# EAGLE design tb_projekt_rf433_shield_mini_revA (EAGLE 7.6.0)
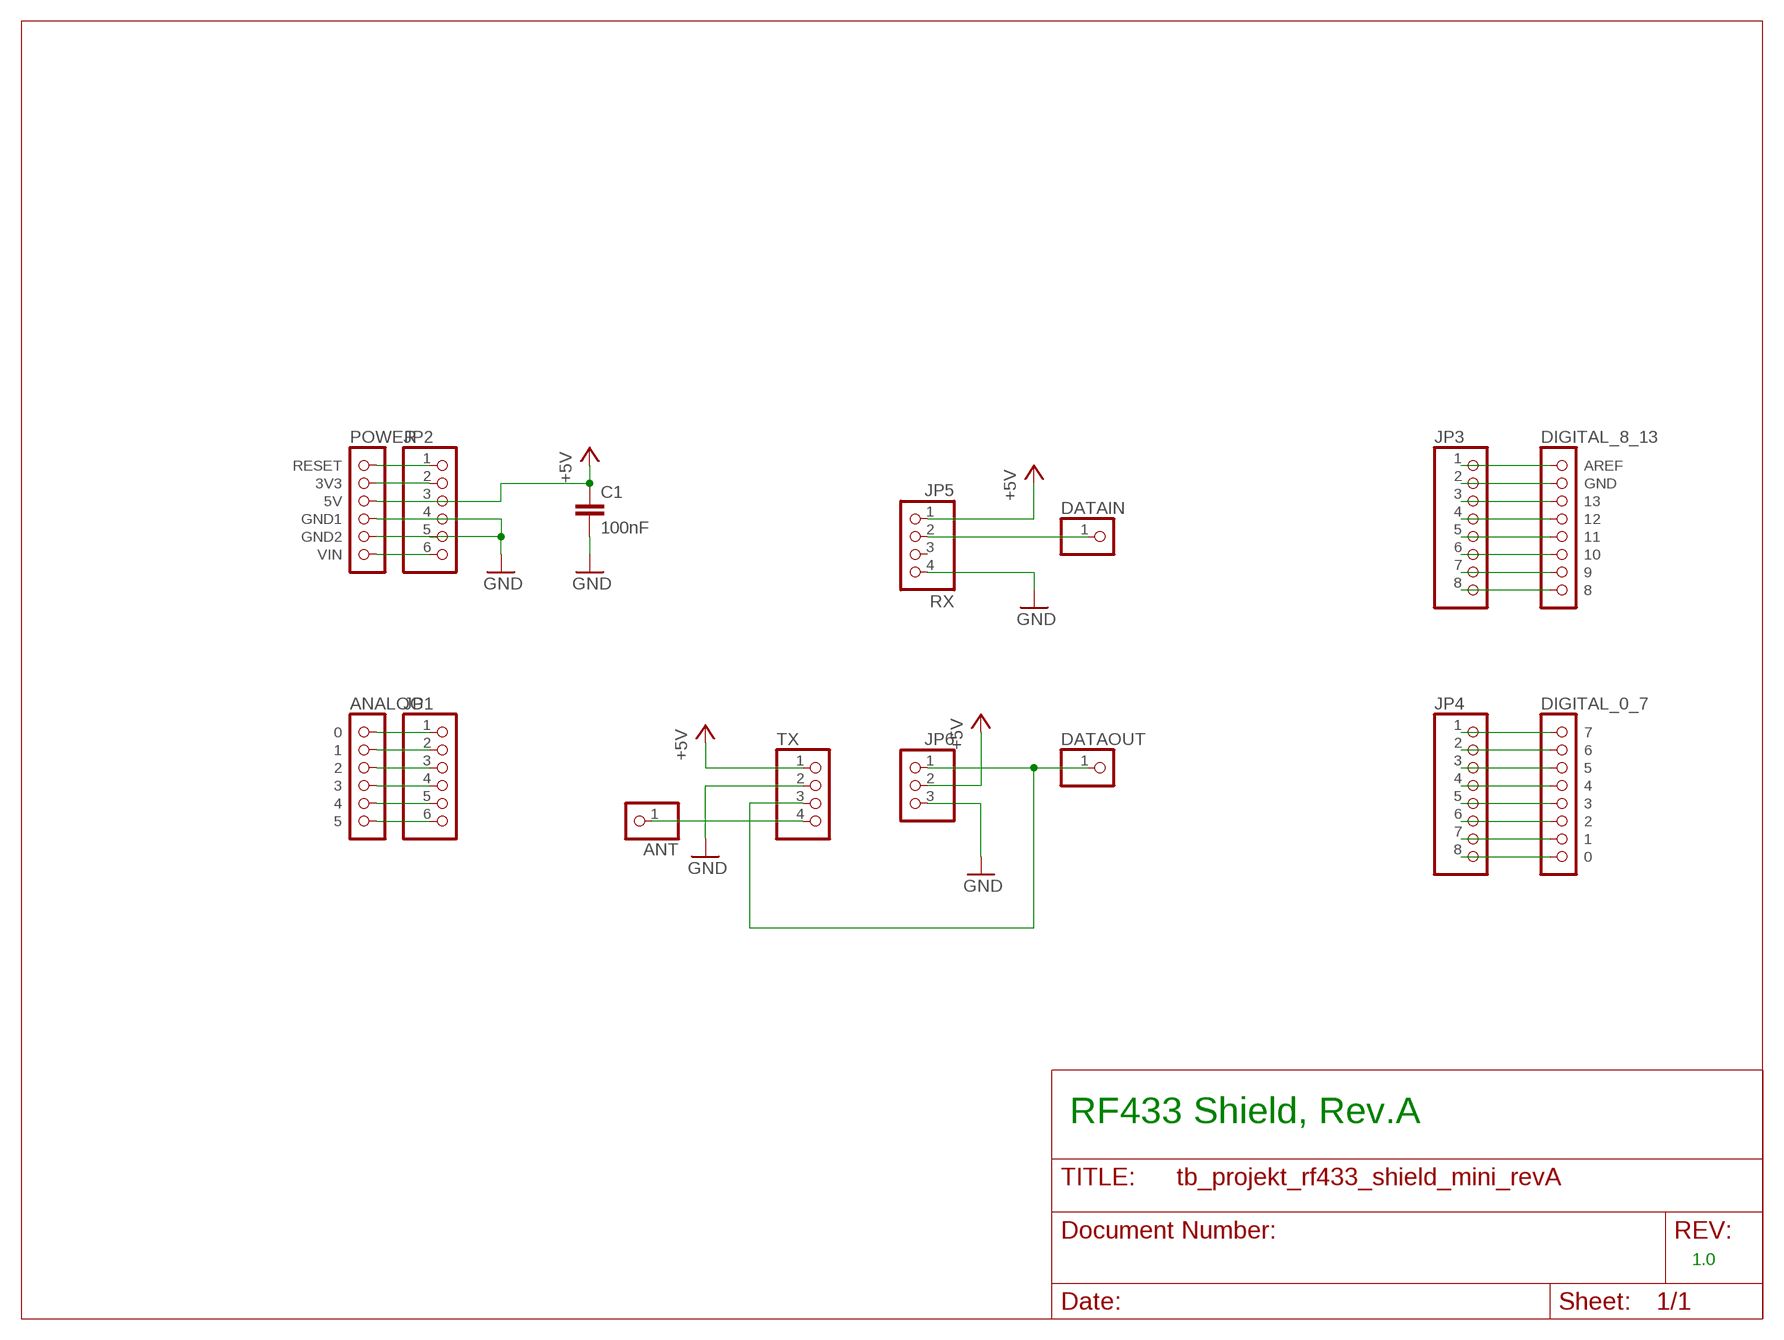
[diagram p0: schematic, sheet 1]

## Parts
ANT  PINHD-1X1  [1X01]
C1  100nF  C-EU025-024X044  [C025-024X044]
DATAIN  PINHD-1X1  [1X01]
DATAOUT  PINHD-1X1  [1X01]
JP1  PINHD-1X6  [1X06]
JP2  PINHD-1X6  [1X06]
JP3  PINHD-1X8  [1X08]
JP4  PINHD-1X8  [1X08]
JP5  RX  PINHD-1X4  [1X04]
JP6  PINHD-1X3  [1X03]
TX  PINHD-1X4  [1X04]
U$1  POWER  [1X06]
U$2  ANALOG  [1X06]
U$3  DIGITAL_0_7  [1X08]
U$4  DIGITAL_8_13  [1X08]

## Nets
+5V: C1.1 JP2.3 JP5.1 JP6.2 TX.1 U$1.3(5V)
GND: C1.2 JP2.4 JP2.5 JP5.4 JP6.3 TX.2 U$1.4(GND1) U$1.5(GND2)
N$1: JP1.1 U$2.1
N$2: JP1.2 U$2.2
N$3: JP2.2 U$1.2(3V3)
N$4: DATAIN.1 JP5.2
N$6: ANT.1 TX.4
N$9: JP4.5 U$3.5
N$10: JP1.3 U$2.3
N$11: JP1.4 U$2.4
N$12: JP1.5 U$2.5
N$13: JP1.6 U$2.6
N$14: JP2.6 U$1.6(VIN)
N$16: JP2.1 U$1.1(RESET)
N$17: JP3.1 U$4.1(AREF)
N$18: JP3.2 U$4.2(GND)
N$19: JP3.3 U$4.3
N$20: JP3.4 U$4.4
N$21: JP3.5 U$4.5
N$22: JP3.7 U$4.7
N$23: JP3.8 U$4.8
N$24: JP4.6 U$3.6
N$25: JP4.7 U$3.7
N$26: JP4.8 U$3.8
N$27: JP4.4 U$3.4
N$28: JP4.3 U$3.3
N$29: JP4.2 U$3.2
N$30: JP4.1 U$3.1
RFDATA: DATAOUT.1 JP6.1 TX.3
SS: JP3.6 U$4.6
Unconnected: JP5.3

## Notes on the sheet
- RF433 Shield, Rev.A
- 1.0

## Library data of the parts
ANT DATAIN DATAOUT = pinhead:PINHD-1X1: PIN HEADER
C1 = resistor:C-EU: CAPACITOR, European symbol
JP1 JP2 = pinhead:PINHD-1X6: PIN HEADER
JP3 JP4 = pinhead:PINHD-1X8: PIN HEADER
JP5 TX = pinhead:PINHD-1X4: PIN HEADER
JP6 = pinhead:PINHD-1X3: PIN HEADER
U$1 = arduino:POWER
U$2 = arduino:ANALOG
U$3 = arduino:DIGITAL_0_7
U$4 = arduino:DIGITAL_8_13

## Board
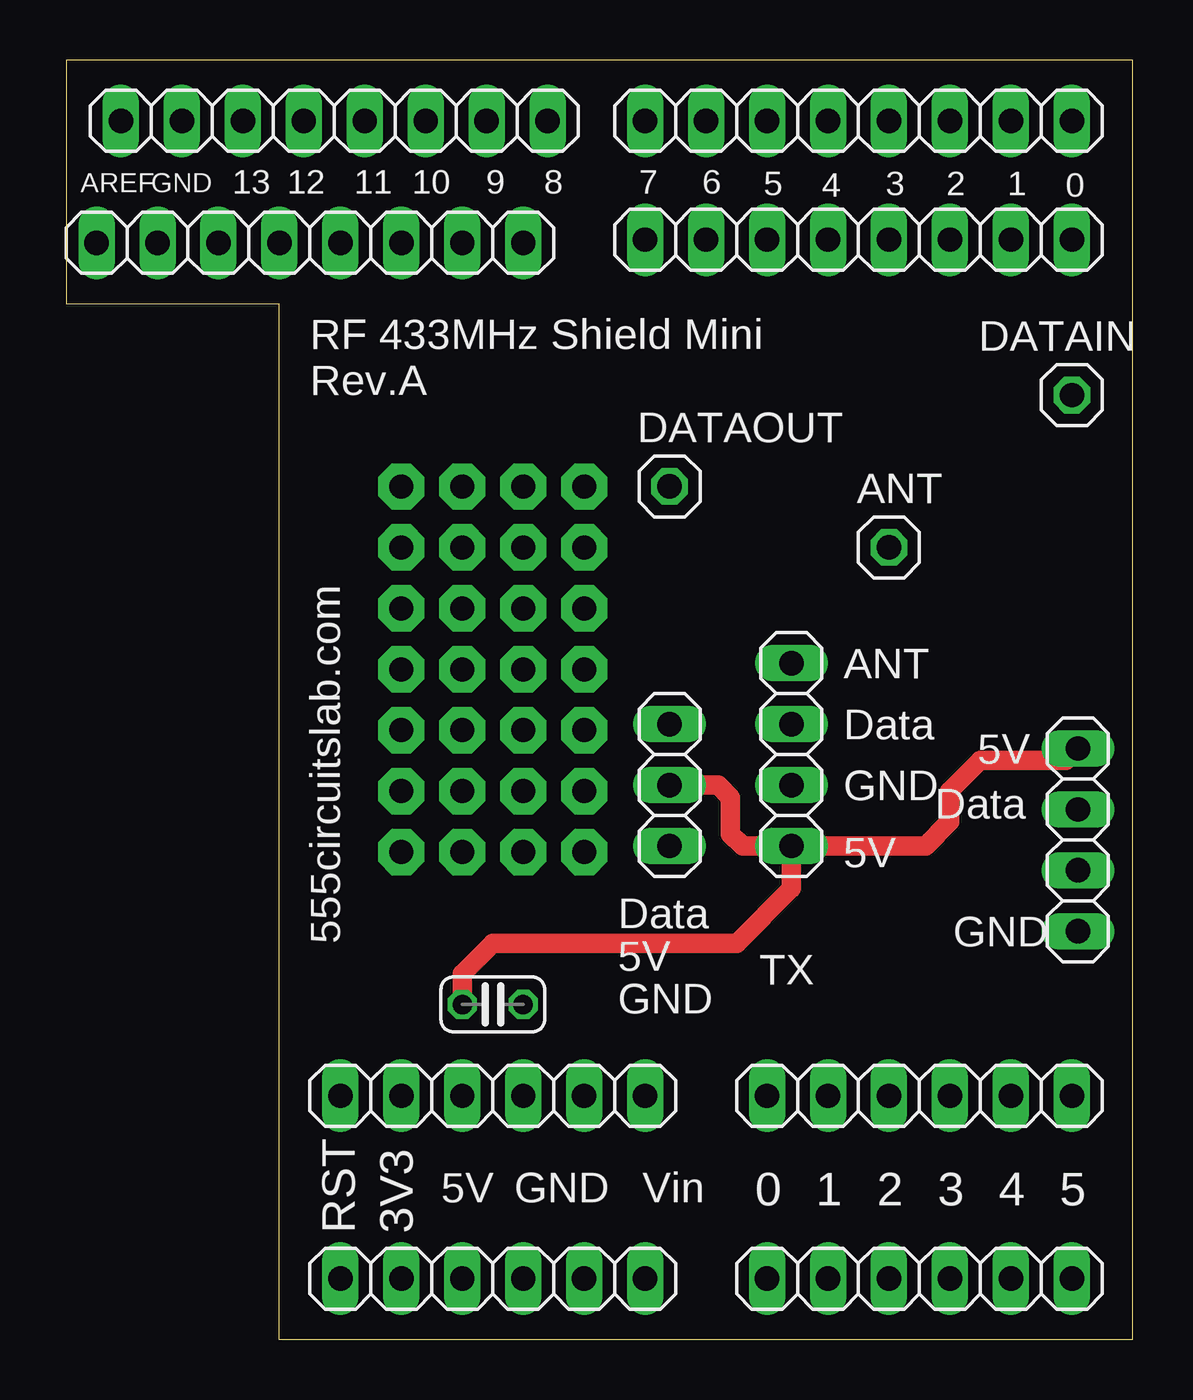
[diagram p1: board, top side]
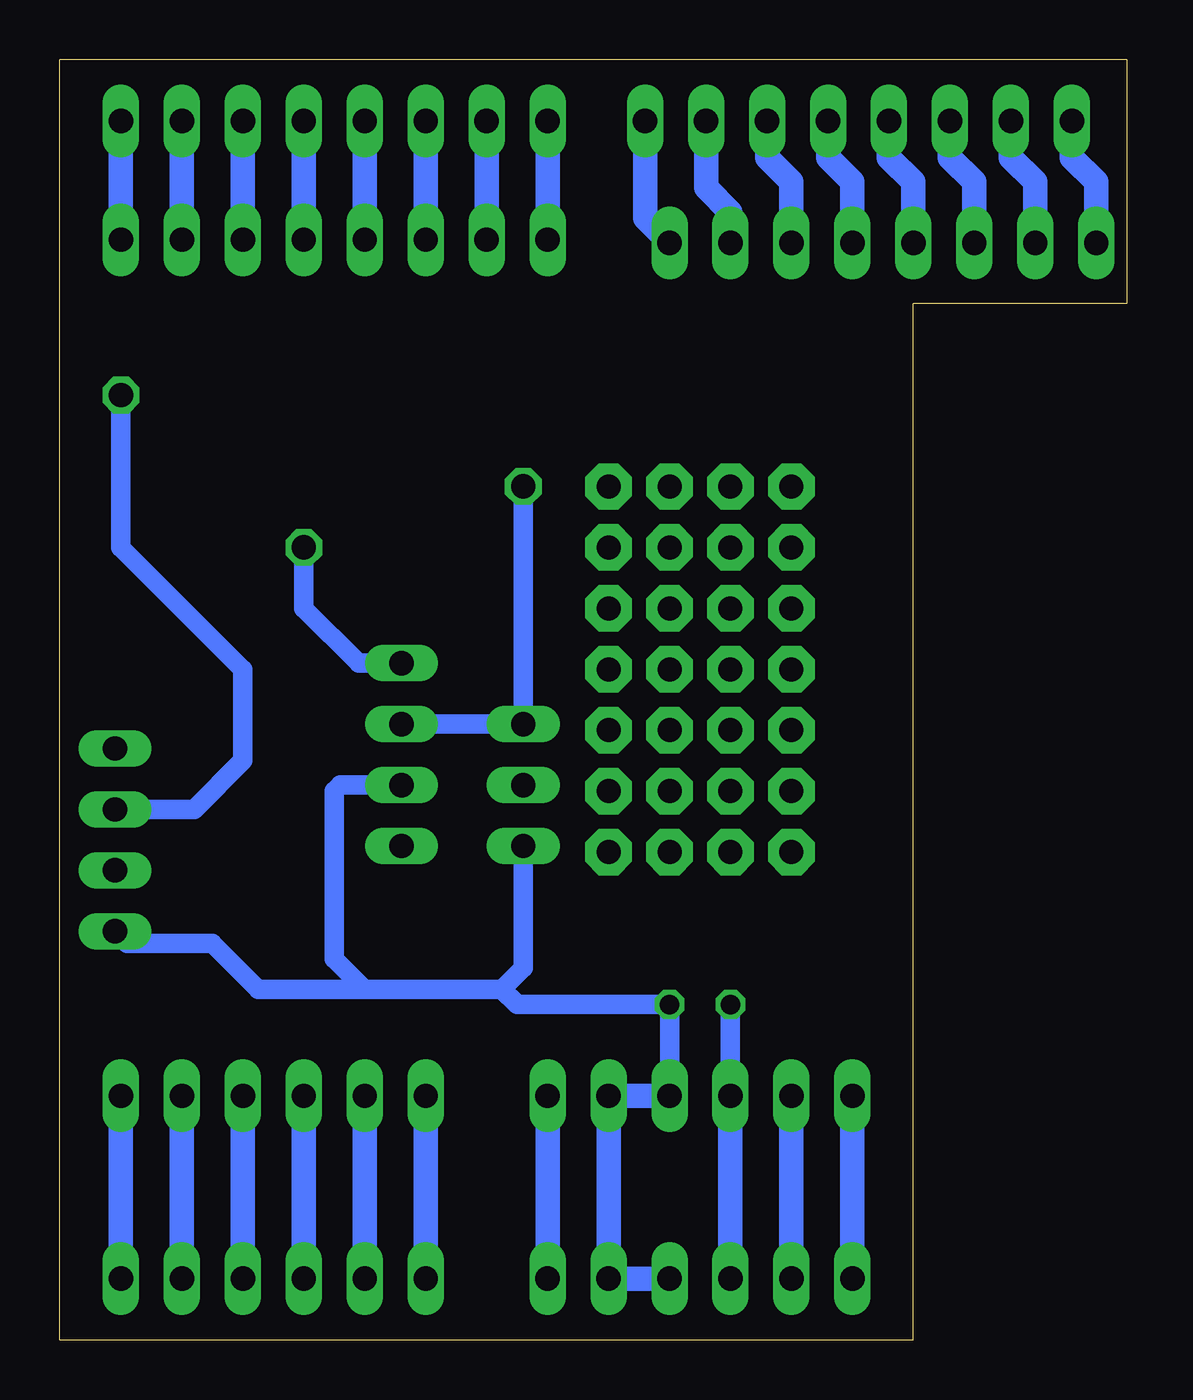
[diagram p2: board, bottom side, seen from below]

Size 44.45 x 53.34 mm. Coordinates in mm from the lower left corner, seen from the top.
Outline: 44.45,0 8.89,0 8.89,43.18 0,43.18 0,53.34 44.45,53.34 44.45,0
Copper layers (1*16): Top 0.0356mm / dielectric 1.5011mm / Bottom 0.0356mm
Design rules "default": minimum track width 6mil, minimum drill 13mil, track to track 6mil, track to pad 6mil, pad to pad 6mil, via to via 6mil, smd to smd 6mil, copper to edge 15mil, drill to drill 6mil, minimum pad ring 7mil, minimum via ring 7mil, stop-mask expansion 4mil, vias tented up to drill 0mil, thermal gap 10mil

### Footprints (pad centres in the part's own frame; a part is rotated, then mirrored left to right if it is on the bottom)
1X01 = drill 1.016 octagon: 1 0,0
C025-024X044 = drill 0.813 octagon: 1 -1.27,0; 2 1.27,0
1X06 = drill 1.016 long: 1 -6.35,0; 2 -3.81,0; 3 -1.27,0; 4 1.27,0; 5 3.81,0; 6 6.35,0
1X08 = drill 1.016 long: 1 -8.89,0; 2 -6.35,0; 3 -3.81,0; 4 -1.27,0; 5 1.27,0; 6 3.81,0; 7 6.35,0; 8 8.89,0
1X04 = drill 1.016 long: 1 -3.81,0; 2 -1.27,0; 3 1.27,0; 4 3.81,0
1X03 = drill 1.016 long: 1 -2.54,0; 2 0,0; 3 2.54,0

### Placement (x,y rotation side)
ANT  34.29,33.02 0 top
C1  17.78,13.97 0 top
DATAIN  41.91,39.37 0 top
DATAOUT  25.15,35.56 0 top
JP1  35.56,10.16 0 top
JP2  17.78,10.16 0 top
JP3  10.16,45.72 0 top
JP4  33.02,45.85 0 top
JP5  42.16,20.83 270 top
JP6  25.15,23.11 270 top
TX  30.23,24.38 90 top
U$1  17.78,2.54 0 top
U$2  35.56,2.54 0 top
U$3  33.02,50.8 0 top
U$4  11.18,50.8 0 top

### Tracks (layer width: path | path; a pad name or v marks a point on that pad's centre or on a via)
+5V
  Top 0.813: TX.1 35.81,20.57 36.83,21.59 36.83,22.86 38.1,24.13 41.66,24.13 JP5.1 | TX.1 30.23,18.8 27.94,16.51 17.78,16.51 16.51,15.24 C1.1 | JP6.2 27.18,23.11 27.69,22.61 27.69,21.08 28.19,20.57 TX.1
  Bottom 0.813: JP2.3 C1.1
  Bottom 1.016: U$1.3 JP2.3
GND
  Bottom 0.813: JP2.4 C1.2 25.4,13.97 26.04,14.61 | JP6.3 25.15,15.49 26.04,14.61 | 26.04,14.61 31.75,14.61 | 31.75,14.61 36.19,14.61 38.1,16.51 41.66,16.51 JP5.4 | TX.2 32.77,23.11 33.02,22.86 33.02,15.88 31.75,14.61
  Bottom 1.016: U$1.4 U$1.5 JP2.5 JP2.4
N$1
  Bottom 1.016: U$2.1 JP1.1
N$2
  Bottom 1.016: U$2.2 JP1.2
N$3
  Bottom 1.016: JP2.2 U$1.2
N$4
  Bottom 0.813: DATAIN.1 41.91,33.02 36.83,27.94 36.83,24.13 38.86,22.1 JP5.2
N$5  (via drill 1 pad 1.93)
  other vias: 19.05,20.32 21.59,20.32 21.59,22.86 21.59,25.4 21.59,27.94 21.59,30.48 21.59,33.02 21.59,35.56 19.05,35.56 16.51,35.56 13.97,35.56 13.97,33.02 13.97,30.48 13.97,27.94 16.51,27.94 16.51,30.48 16.51,33.02 19.05,33.02 19.05,30.48 19.05,27.94
N$6
  Bottom 0.813: TX.4 32,28.19 34.29,30.48 ANT.1
N$7  (via drill 1 pad 1.93)
  other vias: 19.05,22.86 19.05,25.4
N$8  (via drill 1 pad 1.93)
  other vias: 16.51,20.32 13.97,20.32 13.97,22.86 13.97,25.4
N$9
  Bottom 1.016: U$3.5 JP4.5
N$10
  Bottom 1.016: U$2.3 JP1.3
N$11
  Bottom 1.016: U$2.4 JP1.4
N$12
  Bottom 1.016: U$2.5 JP1.5
N$13
  Bottom 1.016: U$2.6 JP1.6
N$14
  Bottom 1.016: U$1.6 JP2.6
N$15  (via drill 1 pad 1.93)
  other vias: 16.51,22.86 16.51,25.4
N$16
  Bottom 1.016: JP2.1 U$1.1
N$17
  Bottom 1.016: U$4.1 2.29,49.28 1.27,48.26 JP3.1
N$18
  Bottom 1.016: U$4.2 4.83,49.28 3.81,48.26 JP3.2
N$19
  Bottom 1.016: U$4.3 7.37,49.28 6.35,48.26 JP3.3
N$20
  Bottom 1.016: U$4.4 9.91,49.28 8.89,48.26 JP3.4
N$21
  Bottom 1.016: U$4.5 12.45,49.28 11.43,48.26 JP3.5
N$22
  Bottom 1.016: U$4.7 17.53,48.01 16.51,46.99 JP3.7
N$23
  Bottom 1.016: U$4.8 20.07,46.74 JP3.8
N$24
  Bottom 1.016: U$3.6 JP4.6
N$25
  Bottom 1.016: U$3.7 JP4.7
N$26
  Bottom 1.016: U$3.8 JP4.8
N$27
  Bottom 1.016: U$3.4 JP4.4
N$28
  Bottom 1.016: U$3.3 JP4.3
N$29
  Bottom 1.016: U$3.2 JP4.2
N$30
  Bottom 1.016: U$3.1 JP4.1 24.13,45.72
RFDATA
  Bottom 0.813: TX.3 JP6.1 DATAOUT.1
SS
  Bottom 1.016: U$4.6 14.99,49.28 13.97,48.26 JP3.6

### Text on the board
tNames: AREF | GND | 13 | 12 | 11 | 10 | 9 | 8 | 7 | 6 | 5 | 4 | 3 | 2 | 1 | 0 | RF 433MHz Shield Mini / Rev.A | ANT | Data | 5V | GND | Data | 5V | 555circuitslab.com | Data | GND | 5V | GND | 5V | GND | Vin | 0 | 1 | 2 | 3 | 4 | 5 | RST | 3V3